# Altium schematic sheet Sheet2.SchDoc
size A4
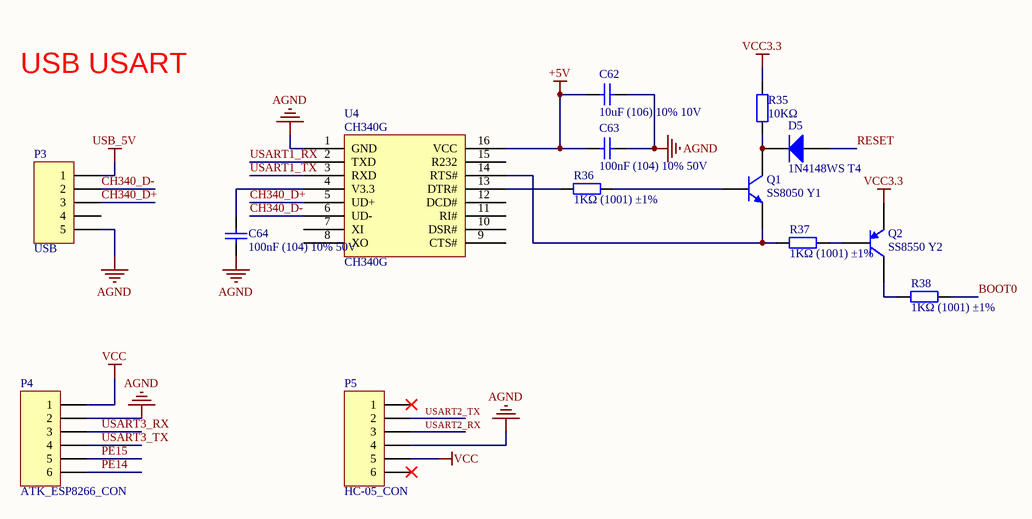
[diagram p0: Sheet2.SchDoc]

## Parts
C62  10uF (106) 10% 10V  [0603_C]
C63  100nF (104) 10% 50V  [0603_C]
C64  100nF (104) 10% 50V  [0603_C]
D5  1N4148WS T4  [SOD-323]
P3  USB  [MICRO-USB]
P4  ATK_ESP8266_CON  [HDR1X6]
P5  HC-05_CON  [HDR1X6]
Q1  SS8050 Y1  [SOT-23(SOT-23-3)]
Q2  SS8550 Y2  [SOT-23(SOT-23-3)]
R35  10KΩ  [0603_R]
R36  1KΩ (1001) ±1%  [0603_R]
R37  1KΩ (1001) ±1%  [0603_R]
R38  1KΩ (1001) ±1%  [0603_R]
U4  CH340G  [SOIC-16_150mil]

## Nets
+5V: C62.1 C63.1 U4.16(VCC)
AGND: C62.2 C63.2 C64.1 P3.5 P4.2 P5.4 U4.1(GND)
USB_5V: P3.1
VCC: P4.1 P5.5
VCC3.3: Q2.2(E) R35.1
BOOT0: R38.2
CH340_D+: P3.3 U4.5(UD+)
CH340_D-: P3.2 U4.6(UD-)
PE14: P4.6
PE15: P4.5
RESET: D5.1(A)
USART1_RX: U4.2(TXD)
USART1_TX: U4.3(RXD)
USART2_RX: P5.3
USART2_TX: P5.2
USART3_RX: P4.3
USART3_TX: P4.4
NetC64_2: C64.2 U4.4(V3.3)
NetD5_2: D5.2(K) Q1.3(C) R35.2
NetQ1_1: Q1.1(B) R36.2
NetQ1_2: Q1.2(E) R37.2 U4.14(RTS#)
NetQ2_1: Q2.1(B) R37.1
NetQ2_3: Q2.3(C) R38.1
NetR36_1: R36.1 U4.13(DTR#)

Not connected (* = marked no-connect by the designer): P3 4; P5 1* 6*; U4 7(XI) 8(XO) 9(CTS#) 10(DSR#) 11(RI#) 12(DCD#) 15(R232)

## Notes on the sheet
- USB USART

## Library data of the parts
C62 = 0603 10uF (106) 10% 10V: 贴片电容; ComponentLink1Description: 供应商链接; ComponentLink1URL: http://www.szlcsc.com/product/details_20411.html; Package: 0603; Supplier: LC; SuppliersPartNumber: C19702
C63 C64 = 0603 100nF (104) 10% 50V: 贴片电容; ComponentLink1Description: 供应商链接; ComponentLink1URL: http://www.szlcsc.com/product/details_15331.html; Package: 0603; Supplier: LC; SuppliersPartNumber: C14663
D5 = SOD-323 1N4148WS T4: 二极管; ComponentLink1Description: 供应商链接; ComponentLink1URL: http://www.szlcsc.com/product/details_2485.html; Package: SOD-323; Supplier: LC; SuppliersPartNumber: C2128
P3 = Header 5: Header, 5-Pin; LatestRevisionDate: 17-Jul-2002; LatestRevisionNote: Re-released for DXP Platform.; Publisher: Altium Limited
P4 P5 = Header 6: Header, 6-Pin; LatestRevisionDate: 17-Jul-2002; LatestRevisionNote: Re-released for DXP Platform.; Publisher: Altium Limited
Q1 = SOT-23 SS8050 Y1: 三极管; ComponentLink1Description: 供应商链接; ComponentLink1URL: http://www.szlcsc.com/product/details_2507.html; Package: SOT-23; Supplier: LC; SuppliersPartNumber: C2150
Q2 = SOT-23 SS8550 Y2: 三极管; ComponentLink1Description: 供应商链接; ComponentLink1URL: http://www.szlcsc.com/product/details_9037.html; Package: SOT-23; Supplier: LC; SuppliersPartNumber: C8542
R35-R38 = 0603 1KΩ (1001) 1%: 贴片电阻; ComponentLink1Description: 供应商链接; ComponentLink1URL: http://www.szlcsc.com/product/details_21904.html; Package: 0603; Supplier: LC; SuppliersPartNumber: C21190
U4 = CH340G_[C14267]: USB; ComponentLink1Description: 供应商链接; ComponentLink1URL: http://www.szlcsc.com/product/details_14927.html; Package: SOIC-16_150mil; Supplier: LC; SuppliersPartNumber: C14267